# EasyEDA schematic MolunSmartHomeKits_2021-06-21.json

## Sheets
1 MolunSmartHomeKits: TITLE: MolunSmartHomeKits; REV: 1.0; Date: 2021-05-26; Sheet: 1/1; Drawn By: molun; Company: molun
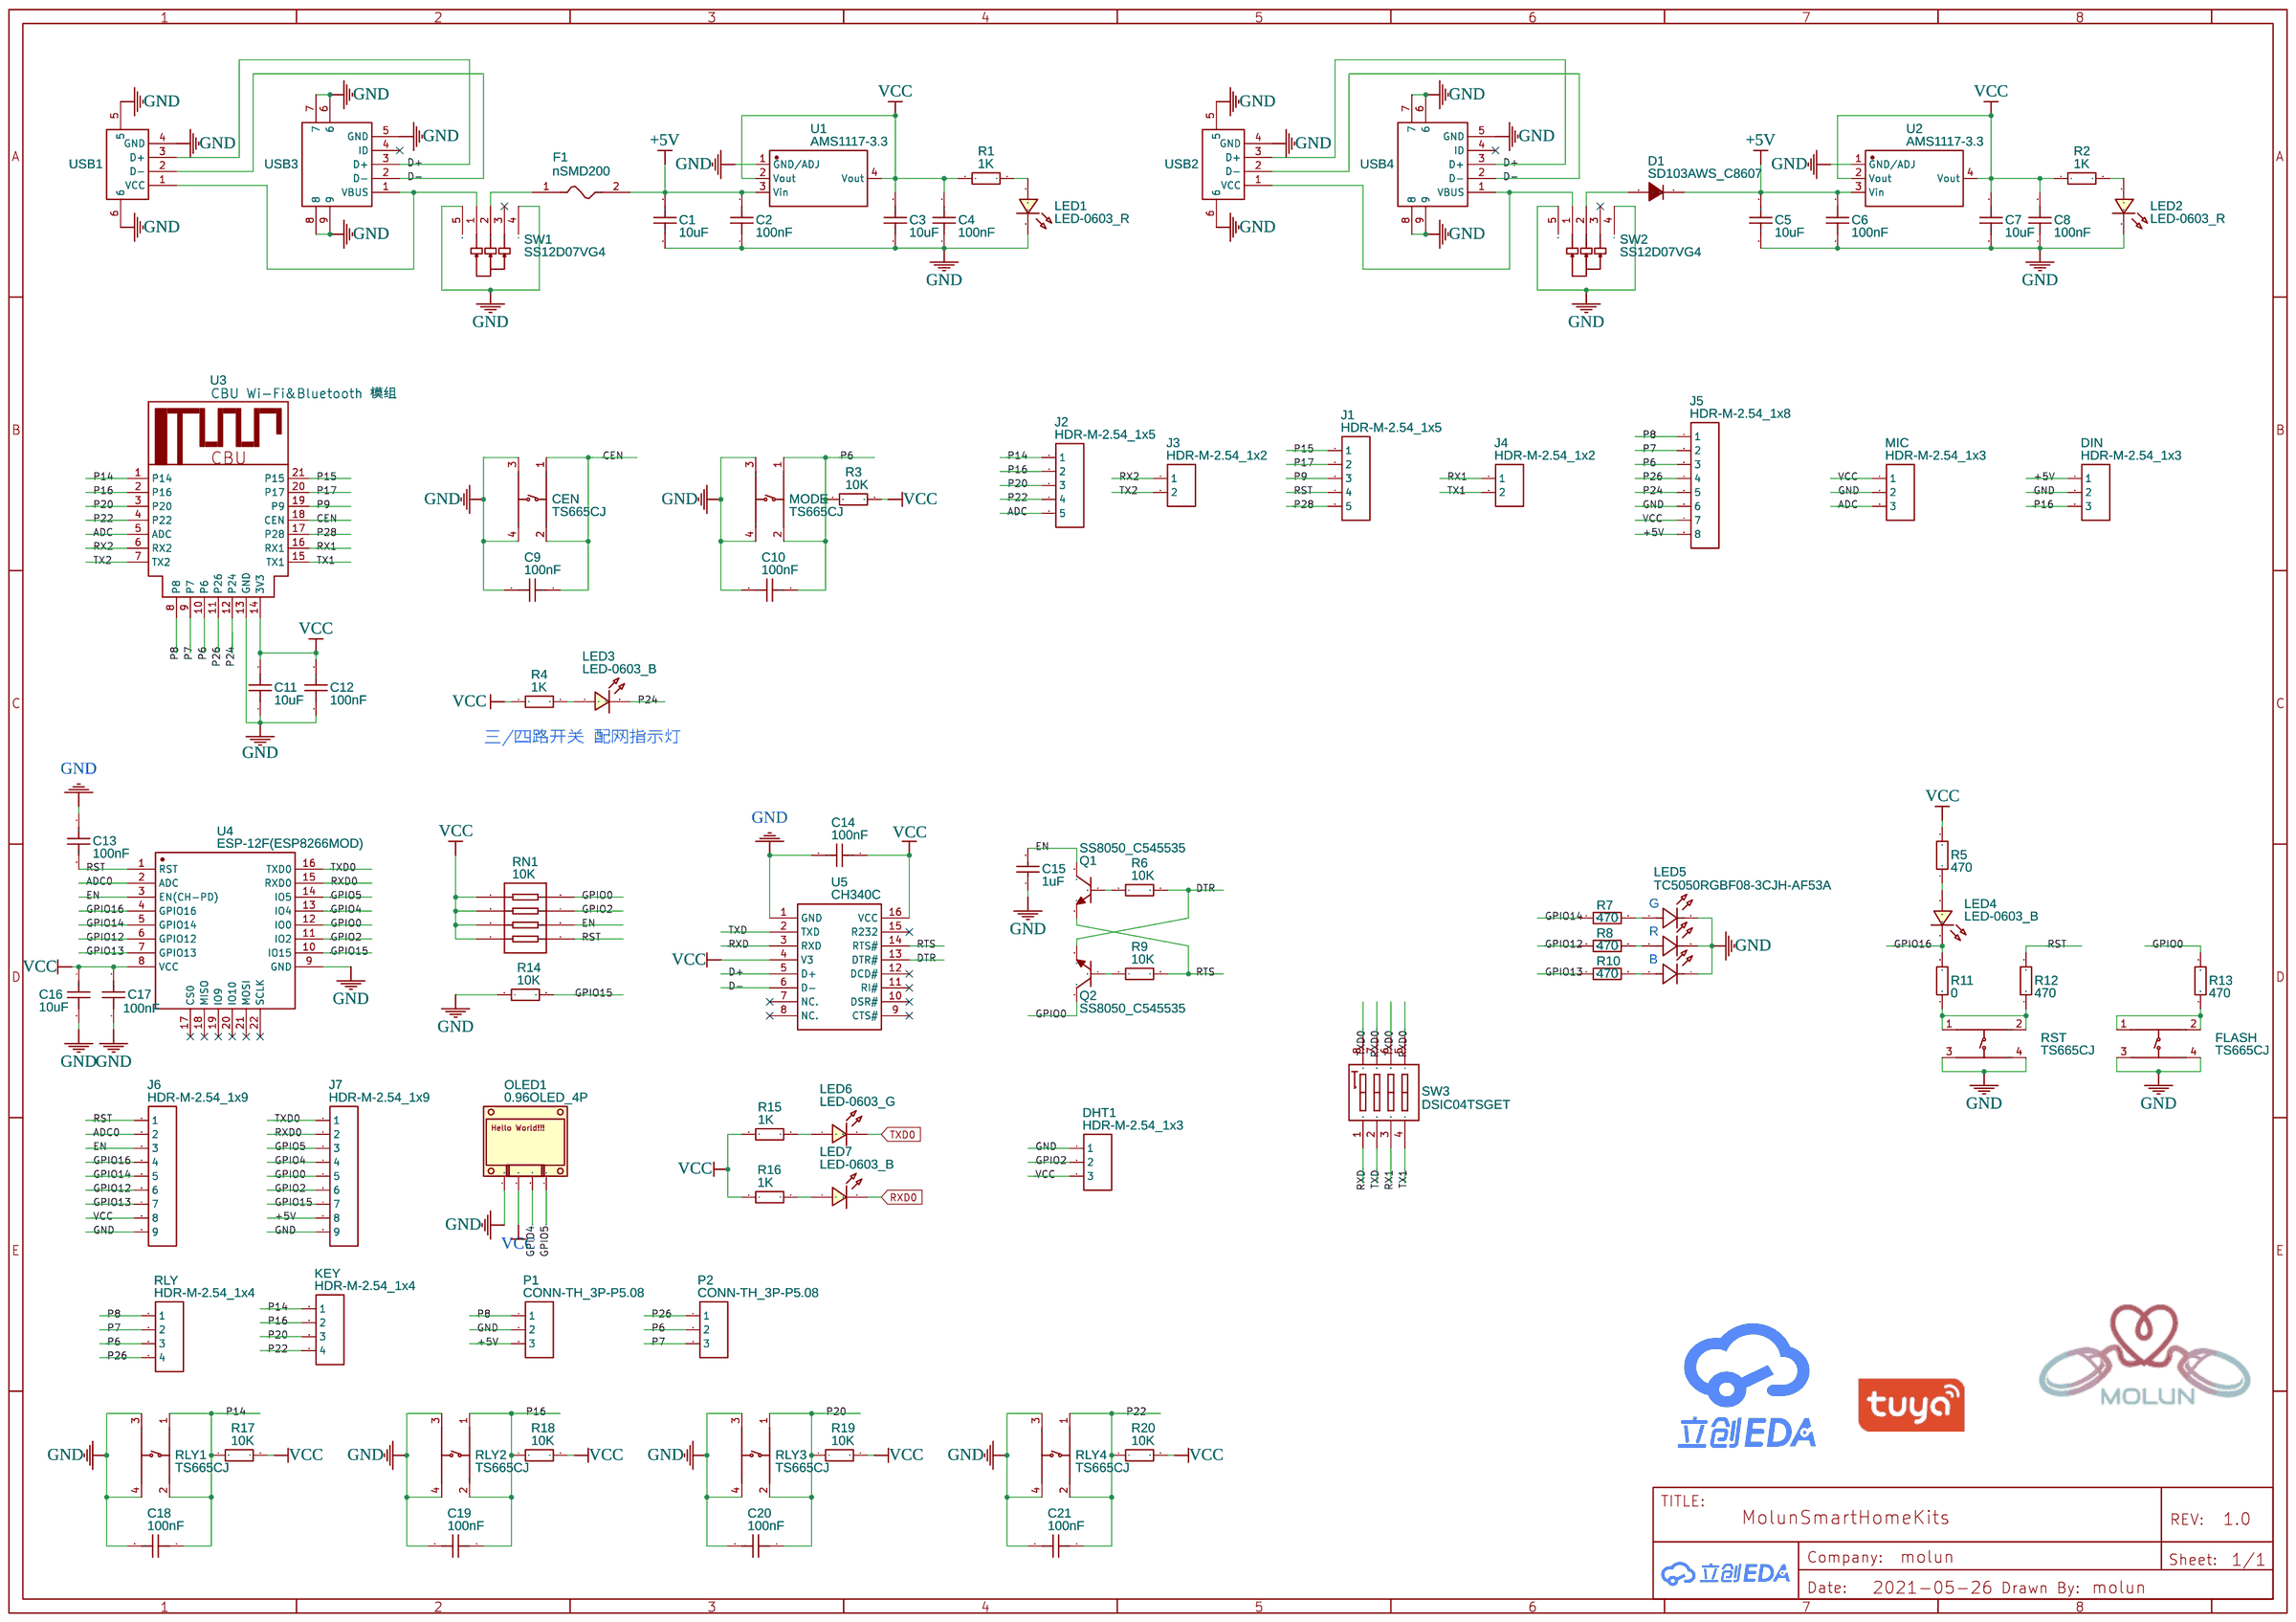
[diagram p0: MolunSmartHomeKits]
2 4合1_WS2812B圆环灯板: TITLE: Sheet_2; Date: 2021-03-10; Company: Your Company
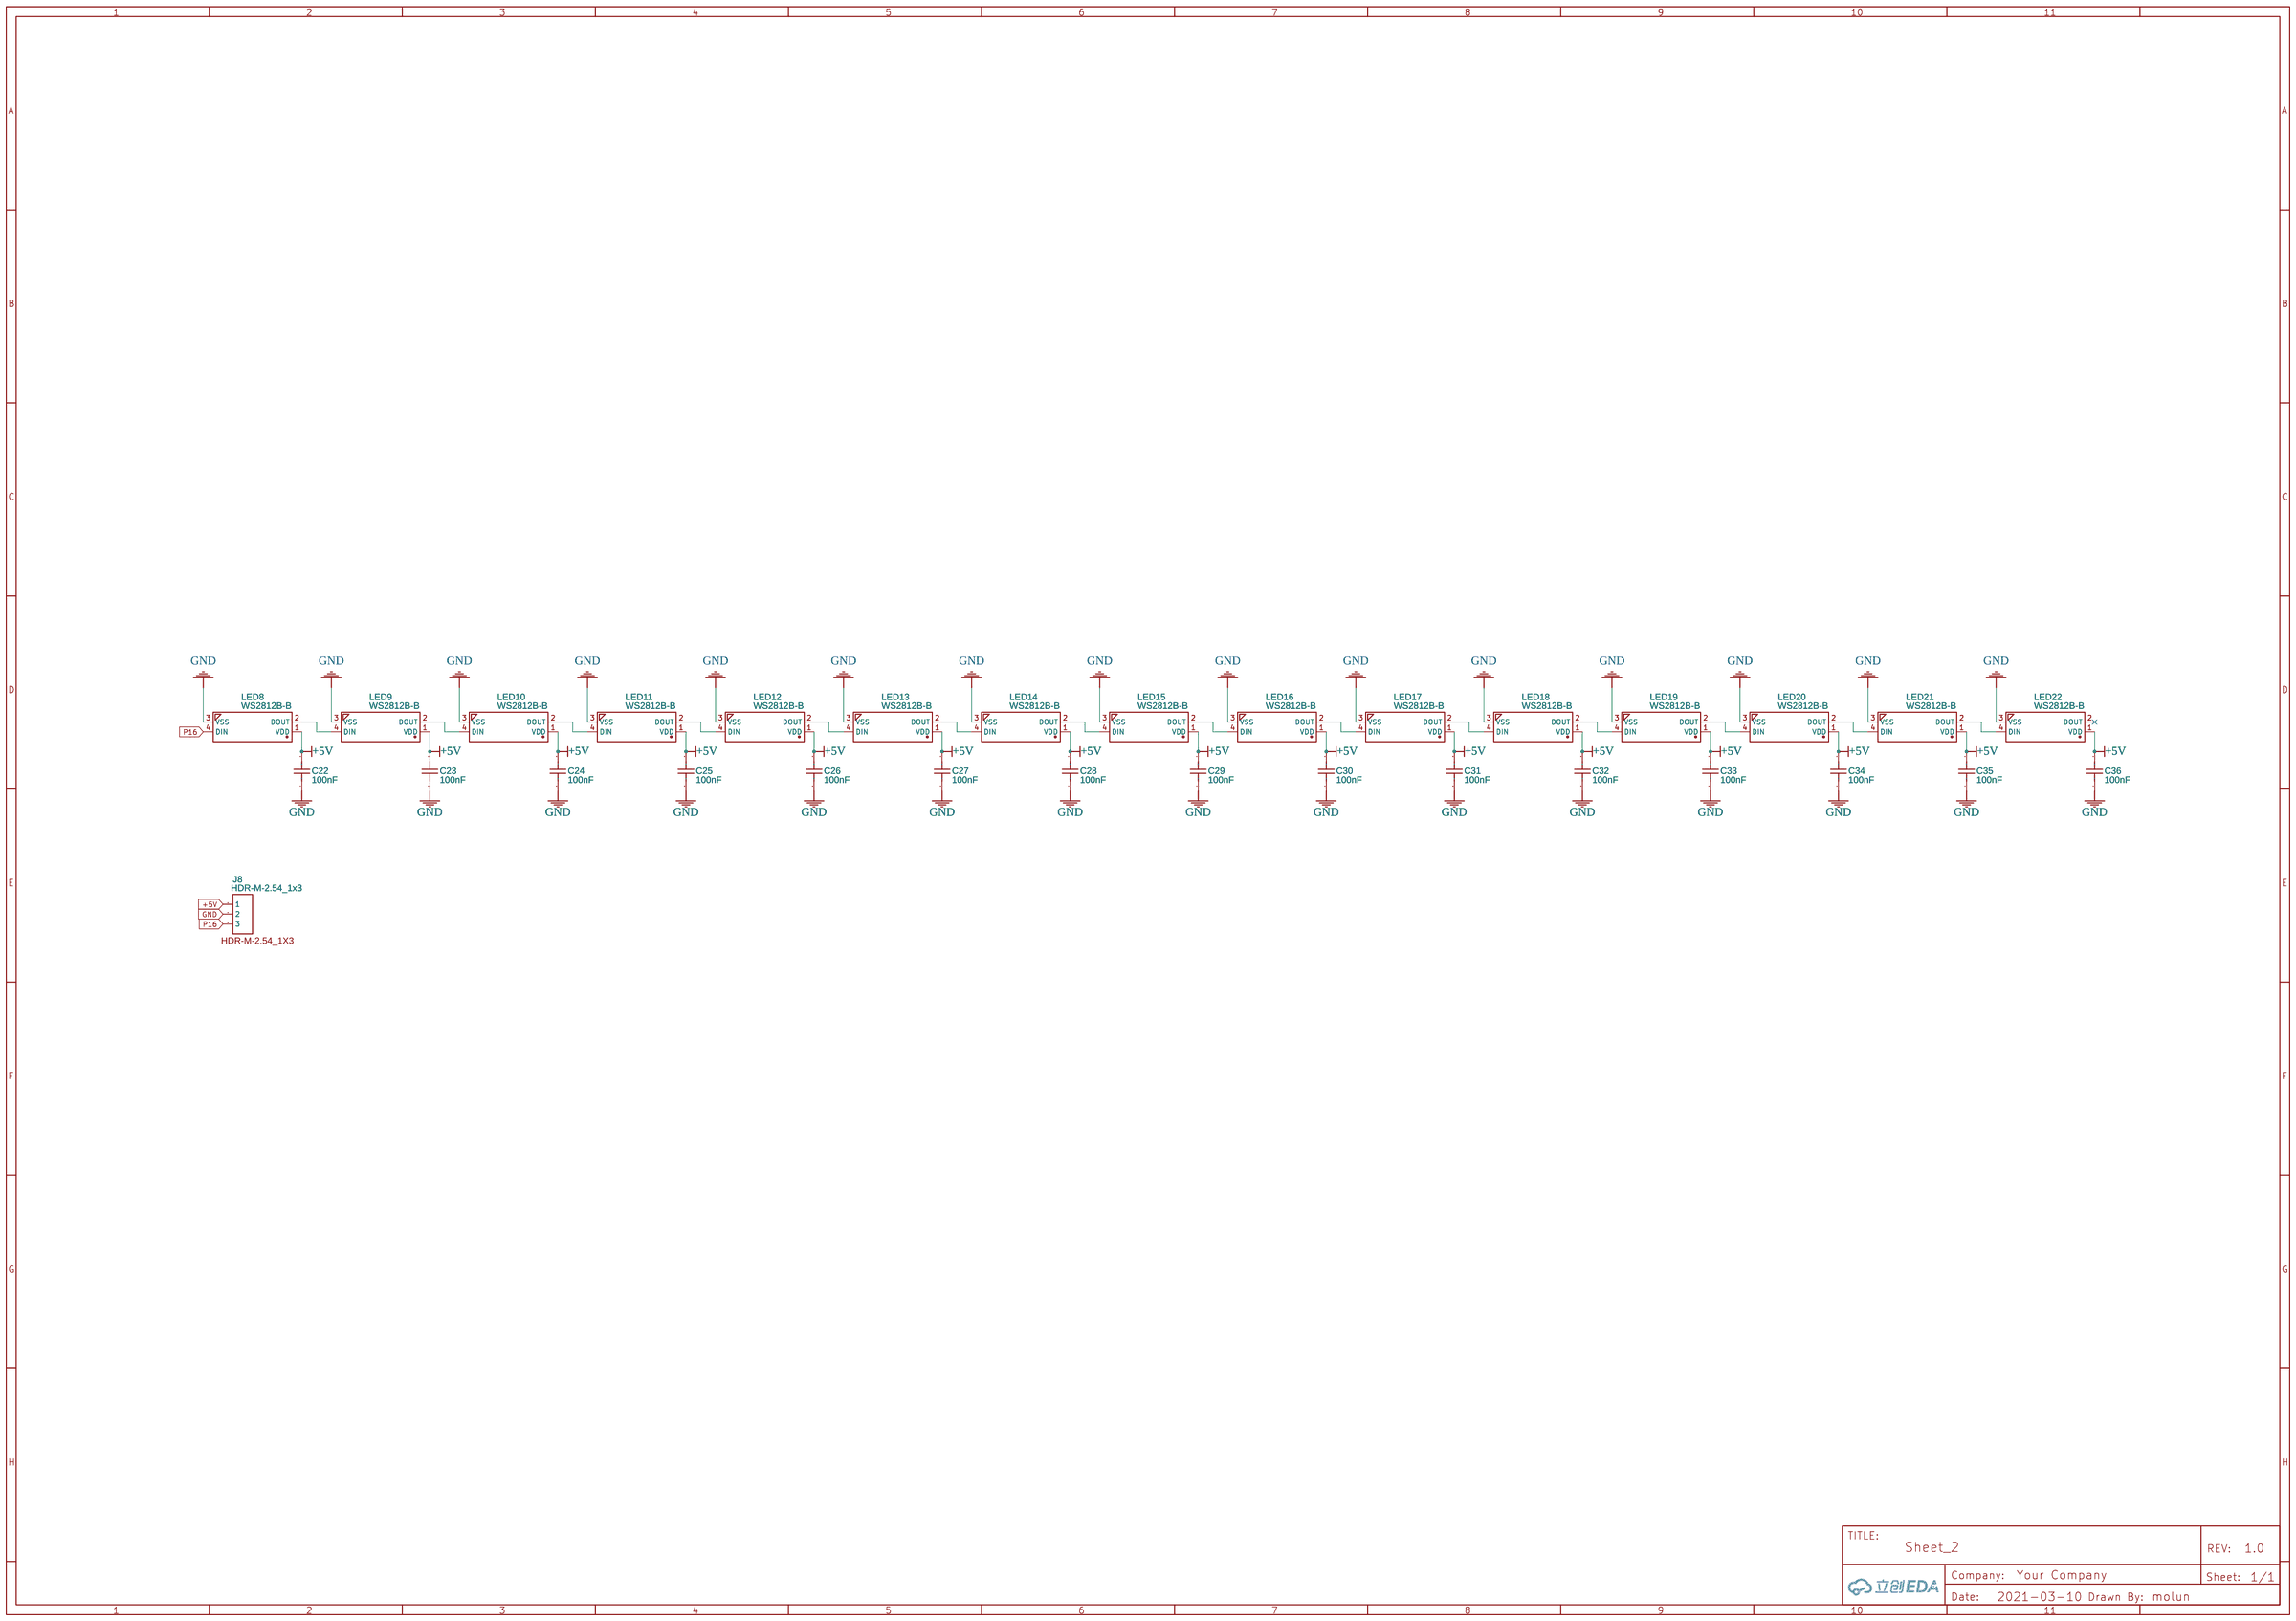
[diagram p1: 4合1_WS2812B圆环灯板]

## Parts
sheet 4合1_WS2812B圆环灯板
C22  100nF  [C0603]
C23  100nF  [C0603]
C24  100nF  [C0603]
C25  100nF  [C0603]
C26  100nF  [C0603]
C27  100nF  [C0603]
C28  100nF  [C0603]
C29  100nF  [C0603]
C30  100nF  [C0603]
C31  100nF  [C0603]
C32  100nF  [C0603]
C33  100nF  [C0603]
C34  100nF  [C0603]
C35  100nF  [C0603]
C36  100nF  [C0603]
J8  HDR-M-2.54_1x3  [HDR-M-2.54_1X3]
LED8  WS2812B-B  [LED-SMD_4P-L5.0-W5.0-TL_WS2812B-B]
LED9  WS2812B-B  [LED-SMD_4P-L5.0-W5.0-TL_WS2812B-B]
LED10  WS2812B-B  [LED-SMD_4P-L5.0-W5.0-TL_WS2812B-B]
LED11  WS2812B-B  [LED-SMD_4P-L5.0-W5.0-TL_WS2812B-B]
LED12  WS2812B-B  [LED-SMD_4P-L5.0-W5.0-TL_WS2812B-B]
LED13  WS2812B-B  [LED-SMD_4P-L5.0-W5.0-TL_WS2812B-B]
LED14  WS2812B-B  [LED-SMD_4P-L5.0-W5.0-TL_WS2812B-B]
LED15  WS2812B-B  [LED-SMD_4P-L5.0-W5.0-TL_WS2812B-B]
LED16  WS2812B-B  [LED-SMD_4P-L5.0-W5.0-TL_WS2812B-B]
LED17  WS2812B-B  [LED-SMD_4P-L5.0-W5.0-TL_WS2812B-B]
LED18  WS2812B-B  [LED-SMD_4P-L5.0-W5.0-TL_WS2812B-B]
LED19  WS2812B-B  [LED-SMD_4P-L5.0-W5.0-TL_WS2812B-B]
LED20  WS2812B-B  [LED-SMD_4P-L5.0-W5.0-TL_WS2812B-B]
LED21  WS2812B-B  [LED-SMD_4P-L5.0-W5.0-TL_WS2812B-B]
LED22  WS2812B-B  [LED-SMD_4P-L5.0-W5.0-TL_WS2812B-B]
sheet MolunSmartHomeKits
C1  10uF  [C0603]
C2  100nF  [C0603]
C3  10uF  [C0603]
C4  100nF  [C0603]
C5  10uF  [C0603]
C6  100nF  [C0603]
C7  10uF  [C0603]
C8  100nF  [C0603]
C9  100nF  [C0603]
C10  100nF  [C0603]
C11  10uF  [C0603]
C12  100nF  [C0603]
C13  100nF  [C0603]
C14  100nF  [C0603]
C15  1uF  [C0603]
C16  10uF  [C0603]
C17  100nF  [C0603]
C18  100nF  [C0603]
C19  100nF  [C0603]
C20  100nF  [C0603]
C21  100nF  [C0603]
CEN  TS665CJ  [SW-TH_4P-L6.0-W6.0-P4.50-LS6.5]
D1  SD103AWS_C8607  [SOD-323_L1.8-W1.3-LS2.5-RD]
DHT1  HDR-M-2.54_1x3  [HDR-M-2.54_1X3]
DIN  HDR-M-2.54_1x3  [HDR-M-2.54_1X3]
F1  nSMD200  [F1206]
FLASH  TS665CJ  [SW-TH_4P-L6.0-W6.0-P4.50-LS6.5]
J1  HDR-M-2.54_1x5  [HDR-M-2.54_1X5]
J2  HDR-M-2.54_1x5  [HDR-M-2.54_1X5]
J3  HDR-M-2.54_1x2  [HDR-M-2.54_1X2]
J4  HDR-M-2.54_1x2  [HDR-M-2.54_1X2]
J5  HDR-M-2.54_1x8  [HDR-M-2.54_1X8]
J6  HDR-M-2.54_1x9  [HDR-M-2.54_1X9]
J7  HDR-M-2.54_1x9  [HDR-M-2.54_1X9]
KEY  HDR-M-2.54_1x4  [HDR-M-2.54_1X4]
LED1  LED-0603_R  [LED0603_RED]
LED2  LED-0603_R  [LED0603_RED]
LED3  LED-0603_B  [LED0603_BLUE]
LED4  LED-0603_B  [LED0603_BLUE]
LED5  TC5050RGBF08-3CJH-AF53A  [LED-SMD_6P-L5.0-W5.0-TR_TC5050RGBF08]
LED6  LED-0603_G  [LED0603_GREEN]
LED7  LED-0603_B  [LED0603_BLUE]
MIC  HDR-M-2.54_1x3  [HDR-M-2.54_1X3]
MODE  TS665CJ  [SW-TH_4P-L6.0-W6.0-P4.50-LS6.5]
OLED1  0.96OLED_4P  [0.96OLED_4P]
P1  CONN-TH_3P-P5.08  [CONN-TH_3P-P5.08]
P2  CONN-TH_3P-P5.08  [CONN-TH_3P-P5.08]
Q1  SS8050_C545535  [SOT-23-3_L2.9-W1.3-P1.90-LS2.4-BR]
Q2  SS8050_C545535  [SOT-23-3_L2.9-W1.3-P1.90-LS2.4-BR]
R1  1K  [R0603]
R2  1K  [R0603]
R3  10K  [R0603]
R4  1K  [R0603]
R5  470  [R0603]
R6  10K  [R0603]
R7  470  [R0603]
R8  470  [R0603]
R9  10K  [R0603]
R10  470  [R0603]
R11  0  [R0603]
R12  470  [R0603]
R13  470  [R0603]
R14  10K  [R0603]
R15  1K  [R0603]
R16  1K  [R0603]
R17  10K  [R0603]
R18  10K  [R0603]
R19  10K  [R0603]
R20  10K  [R0603]
RLY  HDR-M-2.54_1x4  [HDR-M-2.54_1X4]
RLY1  TS665CJ  [SW-TH_4P-L6.0-W6.0-P4.50-LS6.5]
RLY2  TS665CJ  [SW-TH_4P-L6.0-W6.0-P4.50-LS6.5]
RLY3  TS665CJ  [SW-TH_4P-L6.0-W6.0-P4.50-LS6.5]
RLY4  TS665CJ  [SW-TH_4P-L6.0-W6.0-P4.50-LS6.5]
RN1  10K  [RES-ARRAY-SMD_0603-8P-L3.2-W1.6-BL]
RST  TS665CJ  [SW-TH_4P-L6.0-W6.0-P4.50-LS6.5]
SW1  SS12D07VG4  [SW-TH_SS12D07VG4]
SW2  SS12D07VG4  [SW-TH_SS12D07VG4]
SW3  DSIC04TSGET  [SW-SMD_8P-L11.1-W6.2-P2.54-LS9.8]
U1  AMS1117-3.3  [SOT-223-3_L6.5-W3.4-P2.30-LS7.0-BR]
U2  AMS1117-3.3  [SOT-223-3_L6.5-W3.4-P2.30-LS7.0-BR]
U3  CBU Wi-Fi&Bluetooth 模组  [CBU WIFI&BLUETOOTH]
U4  ESP-12F(ESP8266MOD)  [WIFIM-SMD_ESP-12F-ESP8266MOD]
U5  CH340C  [SOP-16_L10.0-W3.9-P1.27-LS6.0-BL]
USB1  U217-04XN-XXR84  [USB-A-SMD_U217-041N-4BV81]
USB2  U217-04XN-XXR84  [USB-A-SMD_U217-041N-4BV81]
USB3  U254-051T-4BH83-F1S  [MICRO-USB-SMD_U254-051T-4BH83-F1S]
USB4  U254-051T-4BH83-F1S  [MICRO-USB-SMD_U254-051T-4BH83-F1S]

## Library data of the parts
C22-C36 = CC0603KRX7R7BB104: Supplier: LCSC; Supplier Part: C108079; Manufacturer: YAGEO; Contributor: LCSC
J8 = HDR-M-2.54_1x3: Supplier Part: C180248; Supplier: LCSC; Contributor: LCEDA_Lib; Package Display: Yes
LED8-LED22 = WS2812B-B: Supplier: LCSC; Manufacturer: Worldsemi; Contributor: LCSC; Supplier Part: C114586; SMT Type: Extend; JLCPCB SMD: Yes
C1 C3 C5 C7 = CC0603KRX5R6BB106: Supplier: LCSC; Supplier Part: C326057; Manufacturer: YAGEO; Contributor: LCSC
C2 C4 C6 C8 = AC0603KRX7R9BB104: Supplier: LCSC; Supplier Part: C149620; Manufacturer: YAGEO; Contributor: LCSC
C9 C10 C12 C13 C17-C21 = CC0603KRX7R7BB104: Supplier: LCSC; Supplier Part: C108079; Manufacturer: YAGEO; Contributor: LCSC; JLCPCB Part Class: Extended Part
C11 C16 = CL10A106MQ8NNNC: Supplier: LCSC; Manufacturer: SAMSUNG; Supplier Part: C1691; JLCPCB Part Class: Extended Part
C14 = AC0603KRX7R9BB104: Supplier: LCSC; Supplier Part: C149620; Manufacturer: YAGEO; Contributor: LCSC; Paste Type: Extended Part; JLCPCB Part Class: Extended Part
C15 = CC0603KRX5R7BB105: Supplier: LCSC; Manufacturer: YAGEO; Contributor: LCSC; Supplier Part: C106215; Paste Type: Extended Part; JLCPCB Part Class: Extended Part
CEN FLASH MODE RLY1-RLY4 RST = TS665CJ: Supplier: LCSC; Supplier Part: C393938; Manufacturer: SHOU HAN; Contributor: LCSC; JLCPCB Part Class: Extended Part
D1 = SD103AWS_C8607: Supplier: LCSC; Manufacturer Part: SD103AWS; Manufacturer: CJ; Supplier Part: C8607; JLCPCB Part Class: Extended Part
DHT1 DIN MIC = HDR-M-2.54_1x3: Supplier Part: C180248; Supplier: LCSC; Contributor: LCEDA_Lib
F1 = nSMD200: Supplier: LCSC; Manufacturer: TECHFUSE; image: //image.lceda.cn/szlcsc/C70085.jpg; Supplier Part: C70085; SMT Type: Extend; JLCPCB SMD: Yes
J1 J2 = HDR-M-2.54_1x5: Supplier Part: C358687; Supplier: LCSC; Contributor: LCEDA_Lib
J3 J4 = HDR-M-2.54_1x2: Supplier Part: C124375; Supplier: LCSC; Contributor: LCEDA_Lib
J5 = HDR-M-2.54_1x8: Supplier Part: C190820; Supplier: LCSC; Contributor: LCEDA_Lib
J6 J7 = HDR-M-2.54_1x9: Supplier Part: C225484; Supplier: LCSC; Contributor: LCEDA_Lib
KEY RLY = HDR-M-2.54_1x4: Supplier Part: C124378; Supplier: LCSC; Contributor: LCEDA_Lib
LED1 LED2 = LED-0603_R: Manufacturer: EVERLIGHT(台湾亿光); Manufacturer Part: 19-217/R6C-AL1M2VY/3T; Supplier Part: C72044; Supplier: LCSC; Contributor: LCEDA_01
LED3 LED4 LED7 = LED-0603_B: Manufacturer: EVERLIGHT(台湾亿光); Manufacturer Part: 19-217/BHC-ZL1M2RY/3T; Supplier Part: C72041; Supplier: LCSC; Contributor: LCEDA_01
LED5 = TC5050RGBF08-3CJH-AF53A: Supplier: LCSC; Supplier Part: C784540; Manufacturer: TCWIN; Contributor: LCSC; JLCPCB Part Class: Extended Part
LED6 = LED-0603_G: Manufacturer: EVERLIGHT(台湾亿光); Manufacturer Part: 19-217/GHC-YR1S2/3T; Supplier Part: C72043; Supplier: LCSC; Contributor: LCEDA_Lib
OLED1 = 0.96OLED_4P: Supplier: LCSC; Contributor: LCEDA_Lib
P1 P2 = CONN-TH_3P-P5.08: Supplier: LCSC; Contributor: LCEDA_Lib
Q1 Q2 = SS8050_C545535: Supplier: LCSC; Supplier Part: C545535; Manufacturer: UMW(Youtai Semiconductor Co., Ltd.); Manufacturer Part: SS8050; Contributor: LCSC
R1 R2 R15 R16 = 0603WAF1001T5E: Supplier: LCSC; Manufacturer: UniOhm; Supplier Part: C21190; SMT Type: Basic; JLCPCB SMD: Yes
R3 R17-R20 = 0603WAJ0103T5E: Supplier: LCSC; Manufacturer: UniOhm; Supplier Part: C15401; JLCPCB Part Class: Extended Part
R4 = 0603WAF1001T5E: Supplier: LCSC; Manufacturer: UniOhm; Supplier Part: C21190; JLCPCB Part Class: Basic Part
R5 R7 R8 R10 R12 R13 = 0603WAF4700T5E: Supplier: LCSC; Manufacturer: UniOhm; Supplier Part: C23179; JLCPCB Part Class: Basic Part
R6 R9 R14 = 0603WAF1002T5E: Supplier: LCSC; Manufacturer: UniOhm; Supplier Part: C25804; JLCPCB Part Class: Basic Part
R11 = AECR0603F0000K9: Supplier: LCSC; Supplier Part: C328332; Manufacturer: ResistorToday; Contributor: LCSC
RN1 = 4D03WGJ0103T5E: Supplier: LCSC; Manufacturer: UniOhm; Supplier Part: C29718; JLCPCB Part Class: Basic Part
SW1 SW2 = SS12D07VG4: Supplier: LCSC; Supplier Part: C431546; Manufacturer: SHOU HAN; Contributor: LCSC; JLCPCB Part Class: Extended Part
SW3 = DSIC04TSGET: Supplier: LCSC; Manufacturer: KE; Supplier Part: C126850; JLCPCB Part Class: Extended Part
U1 U2 = AMS1117-3.3: sourceId: dwIGgezVh; Supplier: LCSC; Manufacturer: AMS; image: //image.lceda.cn/szlcsc/C6186.jpg; Supplier Part: C6186; SMT Type: Basic; JLCPCB SMD: Yes
U3 = CBU Wi-Fi&amp;Bluetooth 模组: Supplier: Tuya; Contributor: chenlf
U4 = ESP-12F(ESP8266MOD): Supplier: LCSC; Manufacturer: Ai-Thinker; Supplier Part: C82891; JLCPCB Part Class: Extended Part
U5 = CH340C: Supplier: LCSC; Manufacturer: WCH; Supplier Part: C84681; Paste Type: Extended Part; JLCPCB Part Class: Extended Part
USB1 USB2 = U217-04XN-XXR84: Supplier: LCSC; Supplier Part: C319178; Manufacturer: XKB Enterprise; Contributor: LCSC; Paste Type: Extended Part; JLCPCB Part Class: Extended Part
USB3 USB4 = U254-051T-4BH83-F1S: Supplier: LCSC; Supplier Part: C397452; Manufacturer: XKB Enterprise; Contributor: LCSC

## Nets
+5V: C1.2 C2.2 C5.2 C6.2 C22.2 C23.2 C24.2 C25.2 C26.2 C27.2 C28.2 C29.2 C30.2 C31.2 C32.2 C33.2 C34.2 C35.2 C36.2 D1.1(C) DIN.1 F1.2 J5.8 J7.8 J8.1 LED8.1(VDD) LED9.1(VDD) LED10.1(VDD) LED11.1(VDD) LED12.1(VDD) LED13.1(VDD) LED14.1(VDD) LED15.1(VDD) LED16.1(VDD) LED17.1(VDD) LED18.1(VDD) LED19.1(VDD) LED20.1(VDD) LED21.1(VDD) LED22.1(VDD) P1.3 U1.3(Vin) U2.3(Vin)
GND: C1.1 C2.1 C3.1 C4.1 C5.1 C6.1 C7.1 C8.1 C9.2 C10.2 C11.2 C12.1 C13.1 C14.2 C15.1 C16.2 C17.1 C18.2 C19.2 C20.2 C21.2 C22.1 C23.1 C24.1 C25.1 C26.1 C27.1 C28.1 C29.1 C30.1 C31.1 C32.1 C33.1 C34.1 C35.1 C36.1 CEN.3(C) CEN.4(D) DHT1.1 DIN.2 FLASH.3(C) FLASH.4(D) J5.6 J6.9 J7.9 J8.2 LED1.2 LED2.2 LED5.4(-) LED5.5(-) LED5.6(-) LED8.3(VSS) LED9.3(VSS) LED10.3(VSS) LED11.3(VSS) LED12.3(VSS) LED13.3(VSS) LED14.3(VSS) LED15.3(VSS) LED16.3(VSS) LED17.3(VSS) LED18.3(VSS) LED19.3(VSS) LED20.3(VSS) LED21.3(VSS) LED22.3(VSS) MIC.2 MODE.3(C) MODE.4(D) OLED1.1 P1.2 R14.1 RLY1.3(C) RLY1.4(D) RLY2.3(C) RLY2.4(D) RLY3.3(C) RLY3.4(D) RLY4.3(C) RLY4.4(D) RST.3(C) RST.4(D) SW1.4 SW1.5 SW2.4 SW2.5 U1.1(GND/ADJ) U2.1(GND/ADJ) U3.13(GND) U4.9(GND) U5.1(GND) USB1.4(GND) USB1.5 USB1.6 USB2.4(GND) USB2.5 USB2.6 USB3.5(GND) USB3.6 USB3.7 USB3.8 USB3.9 USB4.5(GND) USB4.6 USB4.7 USB4.8 USB4.9
VCC: C3.2 C4.2 C7.2 C8.2 C11.1 C12.2 C14.1 C16.1 C17.2 DHT1.3 J5.7 J6.8 MIC.1 OLED1.2 R1.1 R2.1 R3.2 R4.1 R5.2 R15.1 R16.1 R17.2 R18.2 R19.2 R20.2 RN1.1 RN1.2 RN1.3 RN1.4 U1.2(Vout) U1.4(Vout) U2.2(Vout) U2.4(Vout) U3.14(3V3) U4.8(VCC) U5.4(V3) U5.16(VCC)
ADC: J2.5 MIC.3 U3.5(ADC)
ADC0: J6.2 U4.2(ADC)
CEN: C9.1 CEN.1(A) CEN.2(B) U3.18(CEN)
D+: U5.5(D+) USB1.3(D+) USB2.3(D+) USB3.3(D+) USB4.3(D+)
D-: U5.6(D-) USB1.2(D-) USB2.2(D-) USB3.2(D-) USB4.2(D-)
DTR: Q2.2(E) R6.2 U5.13(DTR#)
EN: C15.2 J6.3 Q1.3(C) RN1.6 U4.3(EN(CH-PD))
GPIO0: J7.5 Q2.3(C) R13.2 RN1.8 U4.12(IO0)
GPIO2: DHT1.2 J7.6 RN1.7 U4.11(IO2)
GPIO4: J7.4 OLED1.3 U4.13(IO4)
GPIO5: J7.3 OLED1.4 U4.14(IO5)
GPIO12: J6.6 R8.1 U4.6(GPIO12)
GPIO13: J6.7 R10.1 U4.7(GPIO13)
GPIO14: J6.5 R7.1 U4.5(GPIO14)
GPIO15: J7.7 R14.2 U4.10(IO15)
GPIO16: J6.4 LED4.2 R11.2 U4.4(GPIO16)
P6: C10.1 J5.3 MODE.1(A) MODE.2(B) P2.2 R3.1 RLY.3 U3.10(P6)
P7: J5.2 P2.3 RLY.2 U3.9(P7)
P8: J5.1 P1.1 RLY.1 U3.8(P8)
P9: J1.3 U3.19(P9)
P14: C18.1 J2.1 KEY.1 R17.1 RLY1.1(A) RLY1.2(B) U3.1(P14)
P15: J1.1 U3.21(P15)
P16: C19.1 DIN.3 J2.2 J8.3 KEY.2 LED8.4(DIN) R18.1 RLY2.1(A) RLY2.2(B) U3.2(P16)
P17: J1.2 U3.20(P17)
P20: C20.1 J2.3 KEY.3 R19.1 RLY3.1(A) RLY3.2(B) U3.3(P20)
P22: C21.1 J2.4 KEY.4 R20.1 RLY4.1(A) RLY4.2(B) U3.4(P22)
P24: J5.5 LED3.2 U3.12(P24)
P26: J5.4 P2.1 RLY.4 U3.11(P26)
P28: J1.5 U3.17(P28)
RST: C13.2 J1.4 J6.1 R12.2 RN1.5 U4.1(RST)
RTS: Q1.2(E) R9.2 U5.14(RTS#)
RX1: J4.1 SW3.3(A3) U3.16(RX1)
RX2: J3.1 U3.6(RX2)
RXD: SW3.1(A1) U5.3(RXD)
RXD0: J7.2 LED7.2 SW3.5(B4) SW3.7(B2) U4.15(RXD0)
TX1: J4.2 SW3.4(A4) U3.15(TX1)
TX2: J3.2 U3.7(TX2)
TXD: SW3.2(A2) U5.2(TXD)
TXD0: J7.1 LED6.2 SW3.6(B3) SW3.8(B1) U4.16(TXD0)
Net-(D1-2): D1.2(A) SW2.2
Net-(F1-1): F1.1 SW1.2
Net-(FLASH-1): FLASH.1(A) FLASH.2(B) R13.1
Net-(LED1-1): LED1.1 R1.2
Net-(LED2-1): LED2.1 R2.2
Net-(LED3-1): LED3.1 R4.2
Net-(LED4-1): LED4.1 R5.1
Net-(LED5-1): LED5.1(+) R7.2
Net-(LED5-2): LED5.2(+) R8.2
Net-(LED5-3): LED5.3(+) R10.2
Net-(LED6-1): LED6.1 R15.2
Net-(LED7-1): LED7.1 R16.2
Net-(LED8-2): LED8.2(DOUT) LED9.4(DIN)
Net-(LED9-2): LED9.2(DOUT) LED10.4(DIN)
Net-(LED10-2): LED10.2(DOUT) LED11.4(DIN)
Net-(LED11-2): LED11.2(DOUT) LED12.4(DIN)
Net-(LED12-2): LED12.2(DOUT) LED13.4(DIN)
Net-(LED13-2): LED13.2(DOUT) LED14.4(DIN)
Net-(LED14-2): LED14.2(DOUT) LED15.4(DIN)
Net-(LED15-2): LED15.2(DOUT) LED16.4(DIN)
Net-(LED16-2): LED16.2(DOUT) LED17.4(DIN)
Net-(LED17-2): LED17.2(DOUT) LED18.4(DIN)
Net-(LED18-2): LED18.2(DOUT) LED19.4(DIN)
Net-(LED19-2): LED19.2(DOUT) LED20.4(DIN)
Net-(LED20-2): LED20.2(DOUT) LED21.4(DIN)
Net-(LED21-2): LED21.2(DOUT) LED22.4(DIN)
Net-(Q1-1): Q1.1(B) R6.1
Net-(Q2-1): Q2.1(B) R9.1
Net-(R11-1): R11.1 R12.1 RST.1(A) RST.2(B)
Net-(SW1-1): SW1.1 USB1.1(VCC) USB3.1(VBUS)
Net-(SW2-1): SW2.1 USB2.1(VCC) USB4.1(VBUS)

Not connected (* = marked no-connect by the designer): LED22 2(DOUT)*; SW1 3*; SW2 3*; U4 17(CS0)* 18(MISO)* 19(IO9)* 20(IO10)* 21(MOSI)* 22(SCLK)*; U5 7(NC.)* 8(NC.)* 9(CTS#)* 10(DSR#)* 11(RI#)* 12(DCD#)* 15(R232)*; USB3 4(ID)*; USB4 4(ID)*

## Notes on the sheets
sheet 1
- 三/四路开关 配网指示灯
- G
- R
- B
